# EAGLE design arduheater (EAGLE 9.3.0)
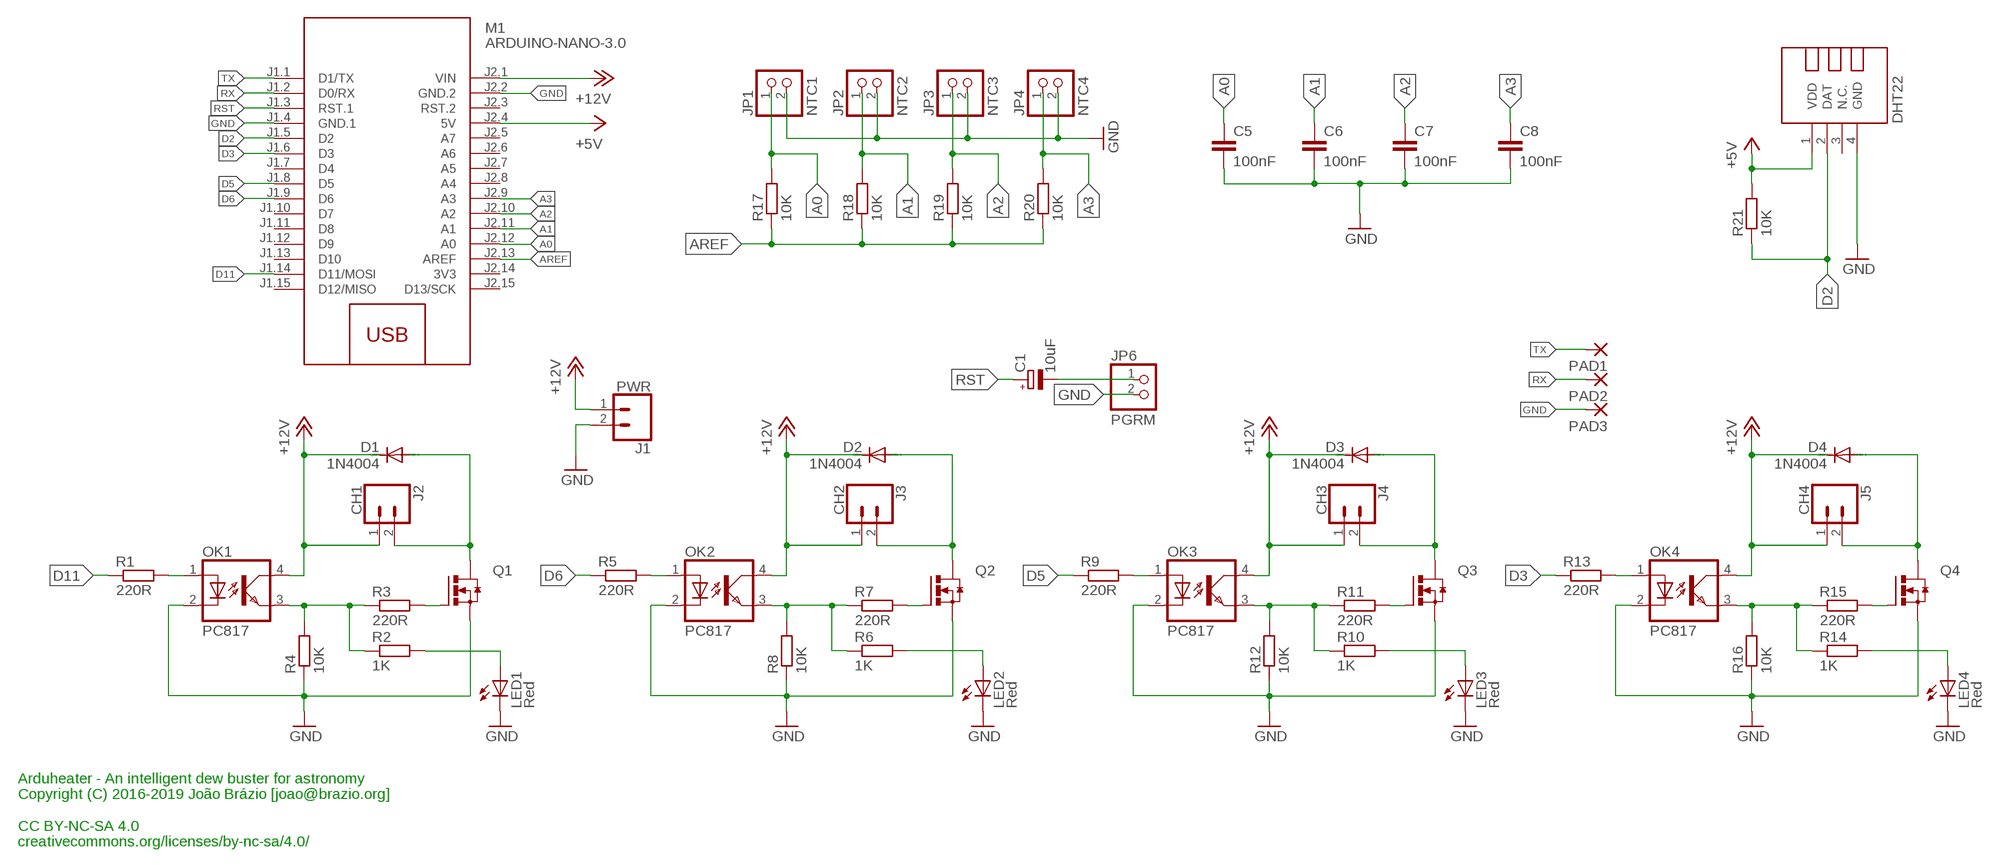
[diagram p0: schematic, sheet 1]

## Parts
C1  10uF  CPOL-EUE2,5-6E  [E2,5-6E]
C5  100nF  C-EUC3216  [C3216]
C6  100nF  C-EUC3216  [C3216]
C7  100nF  C-EUC3216  [C3216]
C8  100nF  C-EUC3216  [C3216]
D1  1N4004  [DO41-10]
D2  1N4004  [DO41-10]
D3  1N4004  [DO41-10]
D4  1N4004  [DO41-10]
DHT22  TEMP-HUM-SENSOR-DHT22  [TEMP-HUM-SENSOR-DHT22]
J1  PWR  CONN_025MM  [SCREWTERMINAL-5MM-2]
J2  CH1  CONN_025MM  [SCREWTERMINAL-5MM-2]
J3  CH2  CONN_025MM  [SCREWTERMINAL-5MM-2]
J4  CH3  CONN_025MM  [SCREWTERMINAL-5MM-2]
J5  CH4  CONN_025MM  [SCREWTERMINAL-5MM-2]
JP1  NTC1  PINHD-1X2  [1X02]
JP2  NTC2  PINHD-1X2  [1X02]
JP3  NTC3  PINHD-1X2  [1X02]
JP4  NTC4  PINHD-1X2  [1X02]
JP6  PGRM  PINHD-1X2  [1X02]
LED1  Red  LED5MM  [LED5MM]
LED2  Red  LED5MM  [LED5MM]
LED3  Red  LED5MM  [LED5MM]
LED4  Red  LED5MM  [LED5MM]
M1  ARDUINO-NANO-3.0  [ARDUINO-NANO-3.0]
OK1  PC817  [DIL04]
OK2  PC817  [DIL04]
OK3  PC817  [DIL04]
OK4  PC817  [DIL04]
PAD1  SMD2  [SMD1,27-2,54]
PAD2  SMD2  [SMD1,27-2,54]
PAD3  SMD2  [SMD1,27-2,54]
Q1  IRF3704L-V  [TO262-V]
Q2  IRF3704L-V  [TO262-V]
Q3  IRF3704L-V  [TO262-V]
Q4  IRF3704L-V  [TO262-V]
R1  220R  R-EU_M1206  [M1206]
R2  1K  R-EU_M1206  [M1206]
R3  220R  R-EU_M1206  [M1206]
R4  10K  R-EU_M1206  [M1206]
R5  220R  R-EU_M1206  [M1206]
R6  1K  R-EU_M1206  [M1206]
R7  220R  R-EU_M1206  [M1206]
R8  10K  R-EU_M1206  [M1206]
R9  220R  R-EU_M1206  [M1206]
R10  1K  R-EU_M1206  [M1206]
R11  220R  R-EU_M1206  [M1206]
R12  10K  R-EU_M1206  [M1206]
R13  220R  R-EU_M1206  [M1206]
R14  1K  R-EU_M1206  [M1206]
R15  220R  R-EU_M1206  [M1206]
R16  10K  R-EU_M1206  [M1206]
R17  10K  R-EU_M1206  [M1206]
R18  10K  R-EU_M1206  [M1206]
R19  10K  R-EU_M1206  [M1206]
R20  10K  R-EU_M1206  [M1206]
R21  10K  R-EU_M1206  [M1206]

## Nets
+5V [pwr5]: DHT22.1(VDD) M1.J2.4(5V) R21.2
+12V [pwr12]: D1.C D2.C D3.C D4.C J1.1 J2.1 J3.1 J4.1 J5.1 M1.J2.1(VIN) OK1.4(COL) OK2.4(COL) OK3.4(COL) OK4.4(COL)
A0: C5.1 JP1.1 M1.J2.12(A0) R17.2
A1: C6.1 JP2.1 M1.J2.11(A1) R18.2
A2: C7.1 JP3.1 M1.J2.10(A2) R19.2
A3: C8.1 JP4.1 M1.J2.9(A3) R20.2
AREF [pwr5]: M1.J2.13(AREF) R17.1 R18.1 R19.1 R20.1
D2: DHT22.2(DAT) M1.J1.5(D2) R21.1
D3: M1.J1.6(D3) R13.1
D5: M1.J1.8(D5) R9.1
D6: M1.J1.9(D6) R5.1
D11: M1.J1.14(D11/MOSI) R1.1
GND: C5.2 C6.2 C7.2 C8.2 DHT22.4(GND) J1.2 JP1.2 JP2.2 JP3.2 JP4.2 JP6.2 LED1.K(C) LED2.K(C) LED3.K(C) LED4.K(C) M1.J1.4(GND.1) M1.J2.2(GND.2) OK1.2(C) OK2.2(C) OK3.2(C) OK4.2(C) PAD3.1(P) Q1.3(S) Q2.3(S) Q3.3(S) Q4.3(S) R4.1 R8.1 R12.1 R16.1
N$1: OK1.1(A) R1.2
N$2: Q1.1(G) R3.2
N$3: OK2.1(A) R5.2
N$4: OK1.3(EMIT) R2.1 R3.1 R4.2
N$6: LED2.A R6.2
N$7 [pwr12]: D1.A J2.2 Q1.2(D)
N$8: OK2.3(EMIT) R6.1 R7.1 R8.2
N$9: Q2.1(G) R7.2
N$10: C1.- JP6.1
N$11 [pwr12]: D2.A J3.2 Q2.2(D)
N$13: OK3.1(A) R9.2
N$14: LED3.A R10.2
N$16: OK3.3(EMIT) R10.1 R11.1 R12.2
N$17: Q3.1(G) R11.2
N$18 [pwr12]: D3.A J4.2 Q3.2(D)
N$19: OK4.1(A) R13.2
N$20: LED4.A R14.2
N$21: OK4.3(EMIT) R14.1 R15.1 R16.2
N$22: Q4.1(G) R15.2
N$23 [pwr12]: D4.A J5.2 Q4.2(D)
N$24: LED1.A R2.2
RST: C1.+ M1.J1.3(RST.1)
RX: M1.J1.2(D0/RX) PAD2.1(P)
TX: M1.J1.1(D1/TX) PAD1.1(P)
Unconnected: DHT22.3(N.C.) M1.J1.7(D4) M1.J1.10(D7) M1.J1.11(D8) M1.J1.12(D9) M1.J1.13(D10) M1.J1.15(D12/MISO) M1.J2.3(RST.2) M1.J2.5(A7) M1.J2.6(A6) M1.J2.7(A5) M1.J2.8(A4) M1.J2.15(D13/SCK)

## Notes on the sheet
- DHT22
- Arduheater - An intelligent dew buster for astronomy
  Copyright (C) 2016-2019 João Brázio [joao@brazio.org]
  
  CC BY-NC-SA 4.0
  creativecommons.org/licenses/by-nc-sa/4.0/

## Power pins joined to a net without a drawn wire
3V3: M1.J2.14(3V3)

## Library data of the parts
C1 = rcl:CPOL-EU: POLARIZED CAPACITOR, European symbol; SPICEPREFIX: C
C5-C8 = rcl:C-EU: CAPACITOR, European symbol; SPICEPREFIX: C
D1-D4 = diode:1N4004: DIODE general purpose rectifier, 1 A
DHT22 = diy-modules:TEMP-HUM-SENSOR-DHT22: DHT22 - digital humidity & temperature sensor Also known as: AM2302 AM2302 datasheet available here: http://akizukidenshi.com/download/ds/aosong/AM2302.pdf Click here to find device on ebay.com <http://www.ebay.com/sch/dht22+digital+sensor>
J1-J5 = SparkFun-Connectors:CONN_02: Multi connection point. Often used as Generic Header-pin footprint for 0.1 inch spaced/style header connections On any of the 0.1 inch spaced packages, you can populate with these: Break Away Headers - Straight <https://www.sparkfun.com/products/116> (PRT-00116) Break Away Male Headers - Right Angle <https://www.sparkfun.com/products/553> (PRT-00553) Female Headers <https://www.sparkfun.com/products/115> (PRT-00115) Break Away Headers - Machine Pin <https://www.sparkfun.com/products/117> (PRT-00117) Break Away Female Headers - Swiss Machine Pin <https://www.sparkfun.com/products/743> (PRT-00743) For SCREWTERMINALS and SPRING TERMINALS visit here: Screw Terimnals on SparkFun.com <https://www.sparkfun.com/search/results?term=Screw+Terminals> (5mm/3.5mm/2.54mm spacing) This device is also useful as a general connection point to wire up your design to another part of your project. Our various solder wires solder well into these plated through hole pads. Hook-Up Wire - Assortment (Stranded, 22 AWG) <https://www.sparkfun.com/products/11375> (PRT-11375) Hook-Up Wire - Assortment (Solid Core, 22 AWG) <https://www.sparkfun.com/products/11367> (PRT-11367) View the entire wire category on our website here <https://www.sparkfun.com/categories/141> Special notes: Molex polarized connector foot print use with: PRT-08233 with associated crimp pins and housings. 2.54_SCREWTERM for use with PRT-10571. 3.5mm Screw Terminal footprints for PRT-08084 5mm Screw Terminal footprints for use with PRT-08432; SF_SKU: PRT-08432
JP1-JP4 JP6 = pinhead:PINHD-1X2: PIN HEADER
LED1-LED4 = led:LED: LED OSRAM: - CHIPLED LG R971, LG N971, LY N971, LG Q971, LY Q971, LO R971, LY R971 LH N974, LH R974 LS Q976, LO Q976, LY Q976 LO Q996 - Hyper CHIPLED LW Q18S LB Q993, LB Q99A, LB R99A - SideLED LS A670, LO A670, LY A670, LG A670, LP A670 LB A673, LV A673, LT A673, LW A673 LH A674 LY A675 LS A676, LA A676, LO A676, LY A676, LW A676 LS A679, LY A679, LG A679 - Hyper Micro SIDELED® LS Y876, LA Y876, LO Y876, LY Y876 LT Y87S - SmartLED LW L88C, LW L88S LB L89C, LB L89S, LG L890 LS L89K, LO L89K, LY L89K LS L896, LA L896, LO L896, LY L896 - TOPLED LS T670, LO T670, LY T670, LG T670, LP T670 LSG T670, LSP T670, LSY T670, LOP T670, LYG T670 LG T671, LOG T671, LSG T671 LB T673, LV T673, LT T673, LW T673 LH T674 LS T676, LA T676, LO T676, LY T676, LB T676, LH T676, LSB T676, LW T676 LB T67C, LV T67C, LT T67C, LS T67K, LO T67K, LY T67K, LW E67C LS E67B, LA E67B, LO E67B, LY E67B, LB E67C, LV E67C, LT E67C LW T67C LS T679, LY T679, LG T679 LS T770, LO T770, LY T770, LG T770, LP T770 LB T773, LV T773, LT T773, LW T773 LH T774 LS E675, LA E675, LY E675, LS T675 LS T776, LA T776, LO T776, LY T776, LB T776 LHGB T686 LT T68C, LB T68C - Hyper Mini TOPLED® LB M676 - Mini TOPLED Santana® LG M470 LS M47K, LO M47K, LY M47K Source: http://www.osram.convergy.de LUXEON: - LUMILED® LXK2-PW12-R00, LXK2-PW12-S00, LXK2-PW14-U00, LXK2-PW14-V00 LXK2-PM12-R00, LXK2-PM12-S00, LXK2-PM14-U00 LXK2-PE12-Q00, LXK2-PE12-R00, LXK2-PE12-S00, LXK2-PE14-T00, LXK2-PE14-U00 LXK2-PB12-K00, LXK2-PB12-L00, LXK2-PB12-M00, LXK2-PB14-N00, LXK2-PB14-P00, LXK2-PB14-Q00 LXK2-PR12-L00, LXK2-PR12-M00, LXK2-PR14-Q00, LXK2-PR14-R00 LXK2-PD12-Q00, LXK2-PD12-R00, LXK2-PD12-S00 LXK2-PH12-R00, LXK2-PH12-S00 LXK2-PL12-P00, LXK2-PL12-Q00, LXK2-PL12-R00 Source: www.luxeon.com KINGBRIGHT: KA-3528ASYC Source: www.kingbright.com
M1 = diy-modules:ARDUINO-NANO-3.0: Arduino Nano 3.0 and compatible devices More details available here: https://www.arduino.cc/en/Main/ArduinoBoardNano Click here to find device on ebay.com <http://www.ebay.com/sch/arduino+nano>
OK1-OK4 = optocoupler:PC817: SHARP OPTO COUPLER; MPN: PC817X4J000F; OC_FARNELL: 9707727; OC_NEWARK: 97K7059
PAD1-PAD3 = wirepad:SMD2: SMD PAD
Q1-Q4 = transistor-power:IRF3704: SMPS MOSFET HEXFET® Power MOSFET Source: http://www.irf.com/product-info/datasheets/data/irf3704.pdf
R1-R21 = rcl:R-EU_: RESISTOR, European symbol; SPICEPREFIX: R

## Net classes
0 default: width 0.254 mm, clearance 0.254 mm
1 pwr5: width 1.143 mm, clearance 0.381 mm
2 pwr12: width 2.286 mm, clearance 0.508 mm

## Board
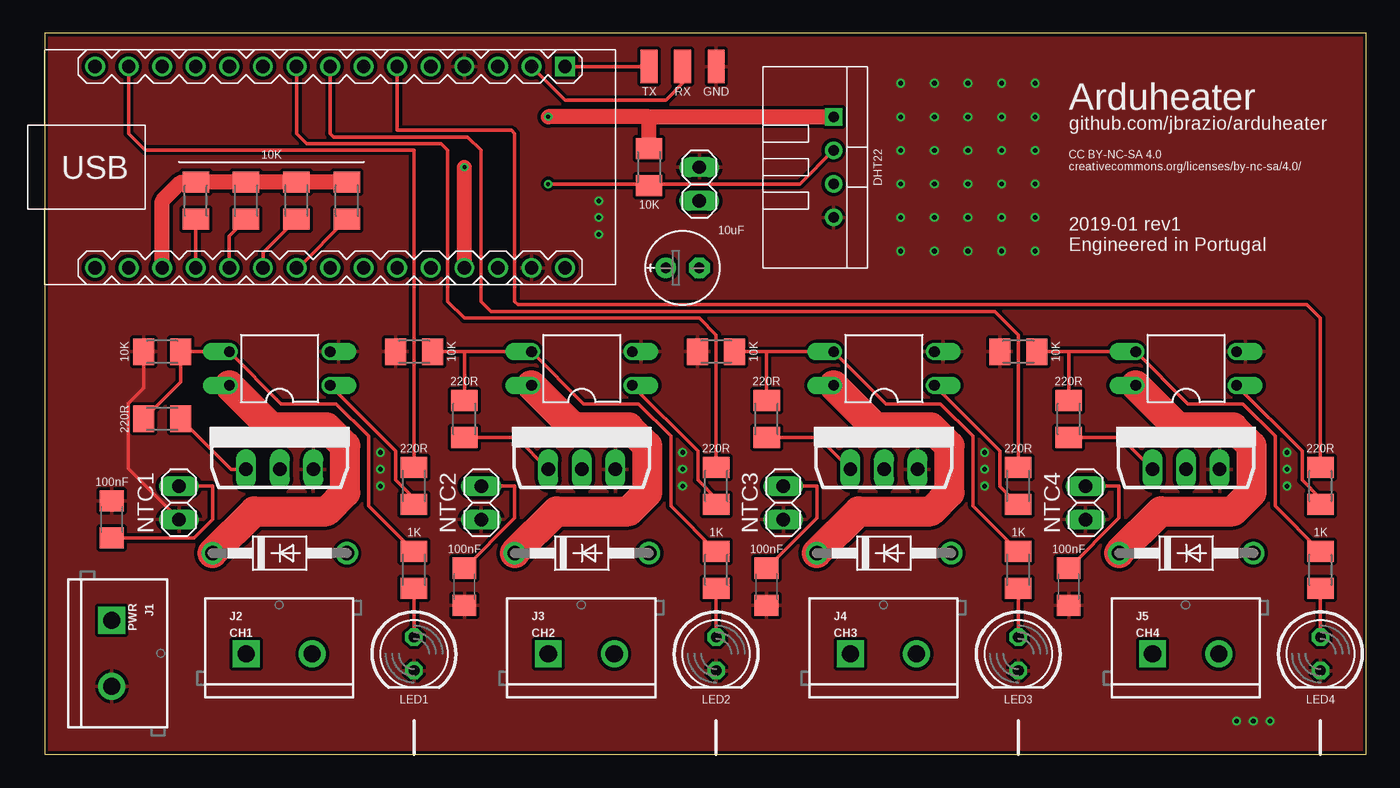
[diagram p1: board, top side]
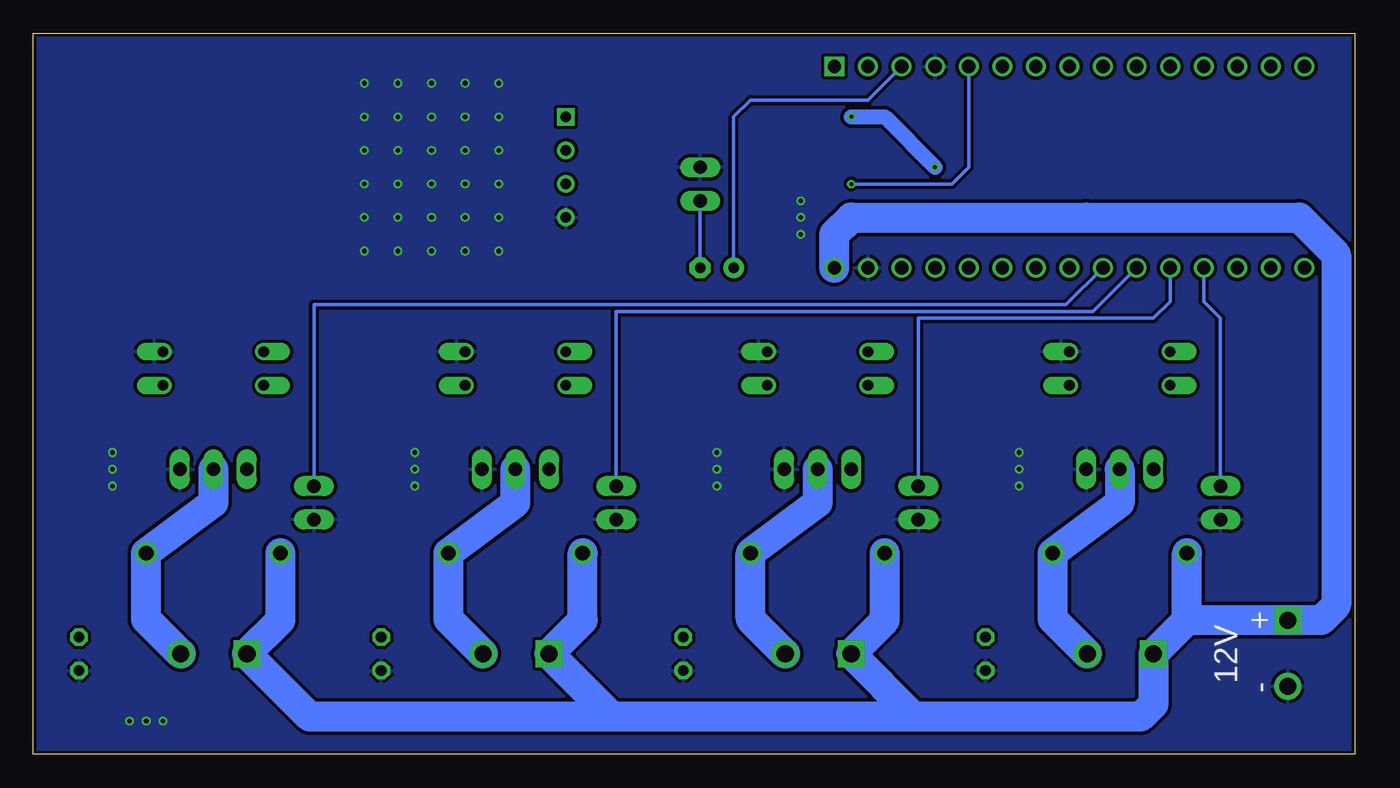
[diagram p2: board, bottom side, seen from below]

Size 100 x 54.6 mm. Coordinates in mm from the lower left corner, seen from the top.
Outline: 0,0 100,0 100,54.6 0,54.6 0,0
Copper layers (1*16): Top 0.035mm / dielectric 1.5mm / Bottom 0.035mm
Design rules "SeeedStudio_2layer_DRU_no_angle_20140221": minimum track width 6mil, minimum drill 12mil, track to track 6mil, track to pad 6mil, pad to pad 6mil, via to via 6mil, smd to smd 0mil, copper to edge 10mil, drill to drill 10mil, minimum pad ring 10mil, minimum via ring 6mil, stop-mask expansion 2mil, vias tented up to drill 100mil, thermal gap 10mil

### Footprints (pad centres in the part's own frame; a part is rotated, then mirrored left to right if it is on the bottom)
E2,5-6E = drill 0.813 pad 1.575: + -1.27,0 | drill 0.813 pad 1.575 octagon: - 1.27,0
C3216 = smd 1.6 x 1.8: 1 -1.4,0; 2 1.4,0
DO41-10 = drill 1.118: A 5.08,0; C -5.08,0
TEMP-HUM-SENSOR-DHT22 = drill 0.8 square: 1 -3.81,0 | drill 0.8: 2 -1.27,0; 3 1.27,0; 4 3.81,0
SCREWTERMINAL-5MM-2 = drill 1.3 pad 2.032 square: 1 0,0 | drill 1.3 pad 2.032: 2 5,0
1X02 = drill 1.016 long: 1 -1.27,0; 2 1.27,0
LED5MM = drill 0.813 octagon: A -1.27,0; K 1.27,0
ARDUINO-NANO-3.0 = drill 1 square: J1.1 17.78,7.62 | drill 1: J1.2 15.24,7.62; J1.3 12.7,7.62; J1.4 10.16,7.62; J1.5 7.62,7.62; J1.6 5.08,7.62; J1.7 2.54,7.62; J1.8 0,7.62; J1.9 -2.54,7.62; J1.10 -5.08,7.62; J1.11 -7.62,7.62; J1.12 -10.16,7.62; J1.13 -12.7,7.62; J1.14 -15.24,7.62; J1.15 -17.78,7.62; J2.1 17.78,-7.62; J2.2 15.24,-7.62; J2.3 12.7,-7.62; J2.4 10.16,-7.62; J2.5 7.62,-7.62; J2.6 5.08,-7.62; J2.7 2.54,-7.62; J2.8 0,-7.62; J2.9 -2.54,-7.62; J2.10 -5.08,-7.62; J2.11 -7.62,-7.62; J2.12 -10.16,-7.62; J2.13 -12.7,-7.62; J2.14 -15.24,-7.62; J2.15 -17.78,-7.62
DIL04 = drill 0.813 offset: 1 -1.27,-3.81; 2 1.27,-3.81; 3 1.27,3.81; 4 -1.27,3.81
SMD1,27-2,54 = smd 1.27 x 2.54: 1 0,0
TO262-V = drill 1.016 long: 1 -2.54,0; 2 0,0; 3 2.54,0
M1206 = smd 1.6 x 2: 1 -1.4,0; 2 1.4,0

### Placement (x,y rotation side)
C1  48.26,36.83 0 top
C5  5.08,17.78 90 top
C6  31.75,12.7 270 top
C7  54.61,12.7 270 top
C8  77.47,12.7 270 top
D1  17.78,15.24 0 top
D2  40.64,15.24 0 top
D3  63.5,15.24 0 top
D4  86.36,15.24 0 top
DHT22  59.69,44.45 270 top
J1  5.08,10.16 270 top
J2  15.24,7.62 0 top
J3  38.1,7.62 0 top
J4  60.96,7.62 0 top
J5  83.82,7.62 0 top
JP1  10.16,19.05 270 top
JP2  33.02,19.05 270 top
JP3  55.88,19.05 270 top
JP4  78.74,19.05 270 top
JP6  49.53,43.18 90 top
LED1  27.94,7.62 270 top
LED2  50.8,7.62 270 top
LED3  73.66,7.62 270 top
LED4  96.52,7.62 270 top
M1  21.59,44.45 0 top
OK1  17.78,29.21 90 top
OK2  40.64,29.21 90 top
OK3  63.5,29.21 90 top
OK4  86.36,29.21 90 top
PAD1  45.72,52.07 180 top
PAD2  48.26,52.07 0 top
PAD3  50.8,52.07 0 top
Q1  17.78,21.59 0 top
Q2  40.64,21.59 0 top
Q3  63.5,21.59 0 top
Q4  86.36,21.59 0 top
R1  27.94,20.32 270 top
R2  27.94,13.97 270 top
R3  8.89,25.4 0 top
R4  8.89,30.48 0 top
R5  50.8,20.32 270 top
R6  50.8,13.97 270 top
R7  31.75,25.4 270 top
R8  27.94,30.48 0 top
R9  73.66,20.32 270 top
R10  73.66,13.97 270 top
R11  54.61,25.4 270 top
R12  50.8,30.48 0 top
R13  96.52,20.32 270 top
R14  96.52,13.97 270 top
R15  77.47,25.4 270 top
R16  73.66,30.48 0 top
R17  11.43,41.91 270 top
R18  15.24,41.91 270 top
R19  19.05,41.91 270 top
R20  22.86,41.91 270 top
R21  45.72,44.45 90 top

### Tracks (layer width: path | path; a pad name or v marks a point on that pad's centre or on a via)
+5V  (via drill 0.3)
  Top 1.143: M1.J2.4 v31.75,44.45 | 45.72,48.26 DHT22.1 | R21.2 45.72,48.26 | 45.72,48.26 v38.1,48.26
  Bottom 1.143: v38.1,48.26 35.56,48.26 v31.75,44.45
+12V
  Top 2.286: D1.C 15.88,18.41 21.32,18.41 22.73,19.83 22.73,23.35 21.32,24.77 17.14,24.77 OK1.4 | OK2.4 40.01,24.77 44.18,24.77 45.59,23.35 45.59,19.83 44.18,18.41 38.73,18.41 D2.C | OK3.4 62.87,24.77 67.04,24.77 68.45,23.35 68.45,19.83 67.04,18.41 61.59,18.41 D3.C | OK4.4 85.72,24.77 89.9,24.77 91.31,23.35 91.31,19.83 89.9,18.41 84.45,18.41 D4.C
  Bottom 2.286: 33.34,2.86 16.19,2.86 15.24,3.81 J2.1 12.7,10.16 | 33.34,2.86 56.2,2.86 | 56.2,2.86 79.06,2.86 J5.1 81.28,10.16 D4.C | 56.2,2.86 J4.1 58.42,10.16 D3.C | 33.34,2.86 J3.1 35.56,10.16 D2.C | 12.7,10.16 D1.C | 12.7,10.16 J1.1 2.54,10.16 1.41,11.29 1.41,37.83 4.22,40.64 20.32,40.64 38.1,40.64 39.37,39.37 M1.J2.1
A0
  Top 0.254: R17.2 M1.J2.12 | C5.1 11.3,16.38 12.7,17.78 12.7,20.32 JP1.1
  Bottom 0.254: JP1.1 10.16,33.02 11.43,34.29 M1.J2.12
A1
  Top 0.254: R18.2 13.97,39.24 M1.J2.11 | C6.1 35.56,17.91 35.56,20.32 JP2.1
  Bottom 0.254: JP2.1 33.02,33.02 15.24,33.02 13.97,34.29 M1.J2.11
A2
  Top 0.254: R19.2 16.51,37.97 M1.J2.10 | C7.1 58.42,17.91 58.42,20.32 JP3.1
  Bottom 0.254: JP3.1 55.88,33.53 19.81,33.53 M1.J2.10
A3
  Top 0.254: R20.2 19.18,36.83 M1.J2.9 | C8.1 81.28,17.91 81.28,20.32 JP4.1
  Bottom 0.254: M1.J2.9 21.84,34.04 78.74,34.04 JP4.1
AREF
  Top 1.143: M1.J2.13 8.89,41.91 10.29,43.31 R17.1 R18.1 R19.1 R20.1
D2  (via drill 0.3)
  Top 0.254: R21.1 45.85,43.18 | DHT22.2 57.15,43.18 45.85,43.18 | v38.1,43.18 45.85,43.18
  Bottom 0.254: v38.1,43.18 30.48,43.18 29.21,44.45 M1.J1.5
D3
  Top 0.254: M1.J1.6 26.67,47.24 35.31,47.24 35.56,46.99 35.56,34.29 35.81,34.04 95.5,34.04 96.52,33.02 R13.1
D5
  Top 0.254: M1.J1.8 21.59,46.99 21.84,46.74 32,46.74 33.02,45.72 33.02,34.29 33.78,33.53 71.88,33.53 73.66,31.75 R9.1
D6
  Top 0.254: M1.J1.9 19.05,46.99 19.81,46.23 29.97,46.23 30.48,45.72 30.48,34.29 31.75,33.02 49.53,33.02 50.8,31.75 R5.1
D11
  Top 0.254: M1.J1.14 6.35,46.99 7.62,45.72 27.94,45.72 R1.1
GND  (via drill 0.35)
  Top 0.254: R4.1 7.49,27.74 6.31,26.56 6.31,21.63 JP1.2
  other vias: 48.26,21.59 48.26,22.86 25.4,22.86 25.4,21.59 71.12,21.59 71.12,22.86 93.98,21.59 93.98,22.86 25.4,20.32 48.26,20.32 71.12,20.32 93.98,20.32 41.91,41.91 41.91,40.64 41.91,39.37 67.31,43.18 69.85,40.64 64.77,45.72 74.93,48.26 67.31,40.64 64.77,43.18 90.17,2.54 91.44,2.54 92.71,2.54 64.77,48.26 67.31,48.26 69.85,48.26 72.39,48.26 67.31,45.72 69.85,45.72 72.39,45.72 74.93,45.72 69.85,43.18 72.39,43.18 74.93,43.18 72.39,40.64 74.93,40.64 64.77,40.64 64.77,38.1 67.31,38.1 69.85,38.1 72.39,38.1 74.93,38.1 64.77,50.8 67.31,50.8 69.85,50.8 72.39,50.8 74.93,50.8
  pour Top: -1.27,-1.27 -1.27,55.88 101.6,55.88 101.6,-1.27
  pour Bottom: -2.54,57.15 102.87,57.15 102.87,-2.54 -2.54,-2.54
N$1
  Top 0.254: OK1.1 26.56,22.97 26.56,20.76 27.94,19.38 R1.2
N$2
  Top 0.254: R3.2 14.1,21.59 Q1.1
N$3
  Top 0.254: OK2.1 49.42,22.97 49.42,20.76 50.8,19.38 R5.2
N$4
  Top 0.254: R3.1 10.29,28.2 R4.2 OK1.3 17.91,26.54 22.06,26.54 24.51,24.09 24.51,18.8 R2.1
N$6
  Top 0.254: R6.2 LED2.A
N$7
  Bottom 2.286: J2.2 22.86,10.24 D1.A 17.78,19.05 Q1.2
N$8
  Top 0.254: R8.2 31.75,30.48 | 31.75,30.48 OK2.3 40.77,26.54 44.92,26.54 47.37,24.09 47.37,18.8 R6.1 | R7.1 31.75,30.48
N$9
  Top 0.254: Q2.1 35.69,24 R7.2
N$10
  Bottom 0.254: JP6.1 C1.-
N$11
  Bottom 2.286: J3.2 45.72,10.24 D2.A 40.64,19.05 Q2.2
N$13
  Top 0.254: R9.2 72.28,20.3 72.28,22.97 OK3.1
N$14
  Top 0.254: R10.2 LED3.A
N$16
  Top 0.254: R12.2 54.61,30.48 | 54.61,30.48 OK3.3 63.63,26.54 67.78,26.54 70.23,24.09 70.23,18.8 R10.1 | R11.1 54.61,30.48
N$17
  Top 0.254: Q3.1 58.55,24 R11.2
N$18
  Bottom 2.286: J4.2 68.58,10.24 D3.A 63.5,19.05 Q3.2
N$19
  Top 0.254: OK4.1 95.14,22.97 95.14,20.76 96.52,19.38 R13.2
N$20
  Top 0.254: R14.2 LED4.A
N$21
  Top 0.254: 77.47,30.48 OK4.3 86.49,26.54 90.64,26.54 93.09,24.09 93.09,18.8 R14.1 | 77.47,30.48 R16.2 | R15.1 77.47,30.48
N$22
  Top 0.254: Q4.1 81.41,24 R15.2
N$23
  Bottom 2.286: J5.2 91.44,10.24 D4.A 86.36,19.05 Q4.2
N$24
  Top 0.254: R2.2 LED1.A
RST
  Bottom 0.254: C1.+ 46.99,48.26 45.72,49.53 36.83,49.53 M1.J1.3
RX
  Top 0.254: PAD2.1 48.26,50.8 46.99,49.53 39.37,49.53 M1.J1.2
TX
  Top 0.254: M1.J1.1 PAD1.1

### Text on the board
tPlace: Arduheater | github.com/jbrazio/arduheater | CC BY-NC-SA 4.0 / creativecommons.org/licenses/by-nc-sa/4.0/ | 2019-01 rev1 / Engineered in Portugal
tNames: TX | RX | GND
bNames: + | 12V | -